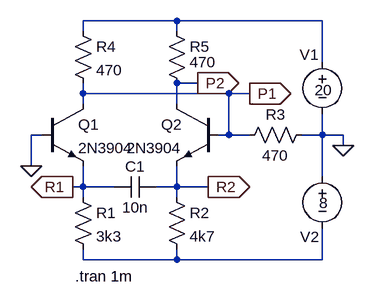
[diagram p0: schematic 1C_Multivib.asc]
1C_Multivib.asc, the LTspice schematic file:
Version 4
SHEET 1 880 680
WIRE -160 256 -160 208
WIRE -144 208 -160 208
WIRE -80 48 -80 32
WIRE -80 144 -80 128
WIRE -80 160 -80 144
WIRE -80 288 -96 288
WIRE -80 288 -80 256
WIRE -80 304 -80 288
WIRE -80 400 -80 384
WIRE -32 288 -80 288
WIRE 64 32 -80 32
WIRE 64 48 64 32
WIRE 64 160 64 128
WIRE 64 288 32 288
WIRE 64 288 64 256
WIRE 64 304 64 288
WIRE 64 400 -80 400
WIRE 64 400 64 384
WIRE 96 128 64 128
WIRE 112 288 64 288
WIRE 144 144 -80 144
WIRE 144 208 128 208
WIRE 144 208 144 144
WIRE 176 144 144 144
WIRE 176 208 144 208
WIRE 288 32 64 32
WIRE 288 96 288 32
WIRE 288 208 256 208
WIRE 288 208 288 176
WIRE 288 272 288 208
WIRE 288 400 64 400
WIRE 288 400 288 352
WIRE 320 208 288 208
WIRE 320 224 320 208
FLAG -160 256 0
FLAG 320 224 0
FLAG 176 144 P1
IOPIN 176 144 Out
FLAG 96 128 P2
IOPIN 96 128 Out
FLAG -96 288 R1
IOPIN -96 288 Out
FLAG 112 288 R2
IOPIN 112 288 Out
SYMBOL npn2 -144 160 R0
SYMATTR InstName Q1
SYMATTR Value 2N3904
SYMBOL npn2 128 160 M0
SYMATTR InstName Q2
SYMATTR Value 2N3904
SYMBOL res -96 288 R0
SYMATTR InstName R1
SYMATTR Value 3k3
SYMBOL res 48 288 R0
SYMATTR InstName R2
SYMATTR Value 4k7
SYMBOL res 272 192 R90
WINDOW 0 0 56 VBottom 0
WINDOW 3 32 56 VTop 0
SYMATTR InstName R3
SYMATTR Value 470
SYMBOL res -96 32 R0
SYMATTR InstName R4
SYMATTR Value 470
SYMBOL res 48 32 R0
WINDOW 3 36 64 Left 0
SYMATTR InstName R5
SYMATTR Value 470
SYMBOL voltage 288 80 R0
WINDOW 0 -35 4 Left 0
WINDOW 3 -12 59 Left 0
SYMATTR InstName V1
SYMATTR Value 20
SYMBOL voltage 288 256 R0
WINDOW 0 -34 109 Left 0
WINDOW 3 -5 57 Left 0
SYMATTR InstName V2
SYMATTR Value 8
SYMBOL cap 32 272 R90
WINDOW 0 0 32 VBottom 0
WINDOW 3 32 32 VTop 0
SYMATTR InstName C1
SYMATTR Value 10n
TEXT -92 426 Left 0 !.tran 1m

The netlist it stands for:
* 1C_Multivib.asc
Q1 P1 0 R1 0 2N3904
Q2 P2 P1 R2 0 2N3904
R1 R1 N002 3k3
R2 R2 N002 4k7
R3 0 P1 470
R4 N001 P1 470
R5 N001 P2 470
V1 N001 0 20
V2 0 N002 8
C1 R2 R1 10n
.model NPN NPN
.model PNP PNP
.lib standard.bjt
.tran 1m
.backanno
.end